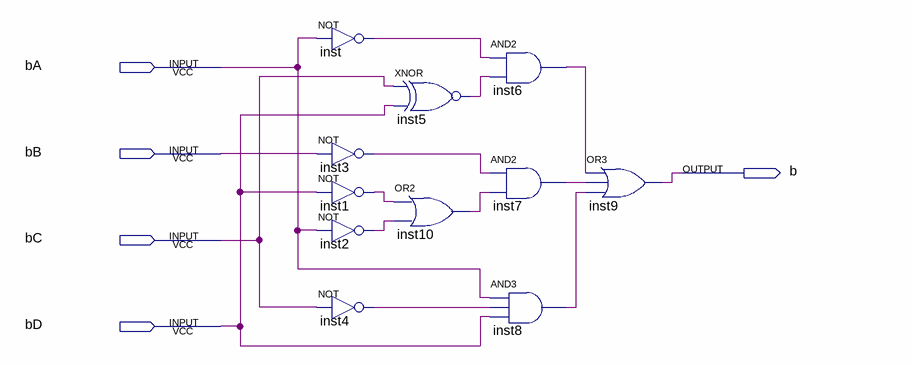
[diagram p0: schematic sheet]
// Quartus schematic segmentoB.bdf as structural Verilog: 11 symbols, 5 pins
module segmentoB (
  input  bA,
  input  bB,
  input  bC,
  input  bD,
  output b
);

  wire inst1_out, inst2_out, inst3_out, inst4_out, inst5_out, inst6_out, inst7_out, inst8_out, inst10_out,
       inst_out;

  not inst (inst_out, bA);
  not inst3 (inst3_out, bB);
  not inst1 (inst1_out, bD);
  not inst2 (inst2_out, bA);
  not inst4 (inst4_out, bC);
  xnor inst5 (inst5_out, bC, bD);
  or inst10 (inst10_out, inst1_out, inst2_out);
  and inst6 (inst6_out, inst_out, inst5_out);
  and inst7 (inst7_out, inst3_out, inst10_out);
  and inst8 (inst8_out, bA, inst4_out, bD);
  or inst9 (b, inst6_out, inst7_out, inst8_out);
endmodule
